# EAGLE design as_wounds_switches (EAGLE 9.6.2)
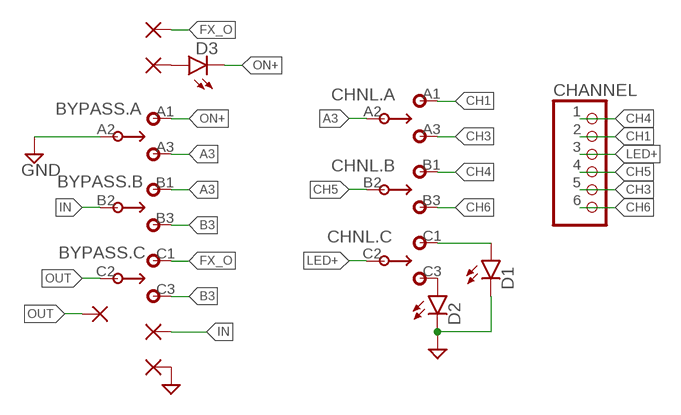
[diagram p0: schematic, sheet 1]

## Parts
BYPASS  3PDT.LUGS  [3PDT.LUGS]
CHANNEL  PINHD-1X6  [1X06]
CHNL  3PDT.LUGS  [3PDT.LUGS]
D1  LED.1  [3MM_IO]
D2  LED.1  [3MM_IO]
D3  LED.1  [3MM_IO]
PAD1  1,6/0,8  [1,6/0,8]
PAD2  1,6/0,8  [1,6/0,8]
PAD3  1,6/0,8  [1,6/0,8]
PAD4  1,6/0,8  [1,6/0,8]
PAD5  1,6/0,8  [1,6/0,8]

## Nets
A3: BYPASS.A3 BYPASS.B1 CHNL.A2
B3: BYPASS.B3 BYPASS.C3
CH1: CHANNEL.2 CHNL.A1
CH3: CHANNEL.5 CHNL.A3
CH4: CHANNEL.1 CHNL.B1
CH5: CHANNEL.4 CHNL.B2
CH6: CHANNEL.6 CHNL.B3
FX_O: BYPASS.C1 PAD1.1(P)
GND: BYPASS.A2 D1.K(C) D2.K(C) PAD4.1(P)
IN: BYPASS.B2 PAD3.1(P)
LED+: CHANNEL.3 CHNL.C2
N$1: CHNL.C3 D2.A
N$2: CHNL.C1 D1.A
N$4: D3.A PAD2.1(P)
ON+: BYPASS.A1 D3.K(C)
OUT: BYPASS.C2 PAD5.1(P)

## Library data of the parts
BYPASS CHNL = switches:3PDT: 3PDT Switches
CHANNEL = pinhead:PINHD-1X6: PIN HEADER
D1-D3 = diodes:LED: LEDs, all sizes 3mm: http://smallbear-electronics.mybigcommerce.com/led-t-1-3mm-diffused-colors/ 5mm: http://smallbear-electronics.mybigcommerce.com/led-t-1-3-4-5mm-diffused/
PAD1-PAD5 = wirepad:1,6/0,8: THROUGH-HOLE PAD

## Board
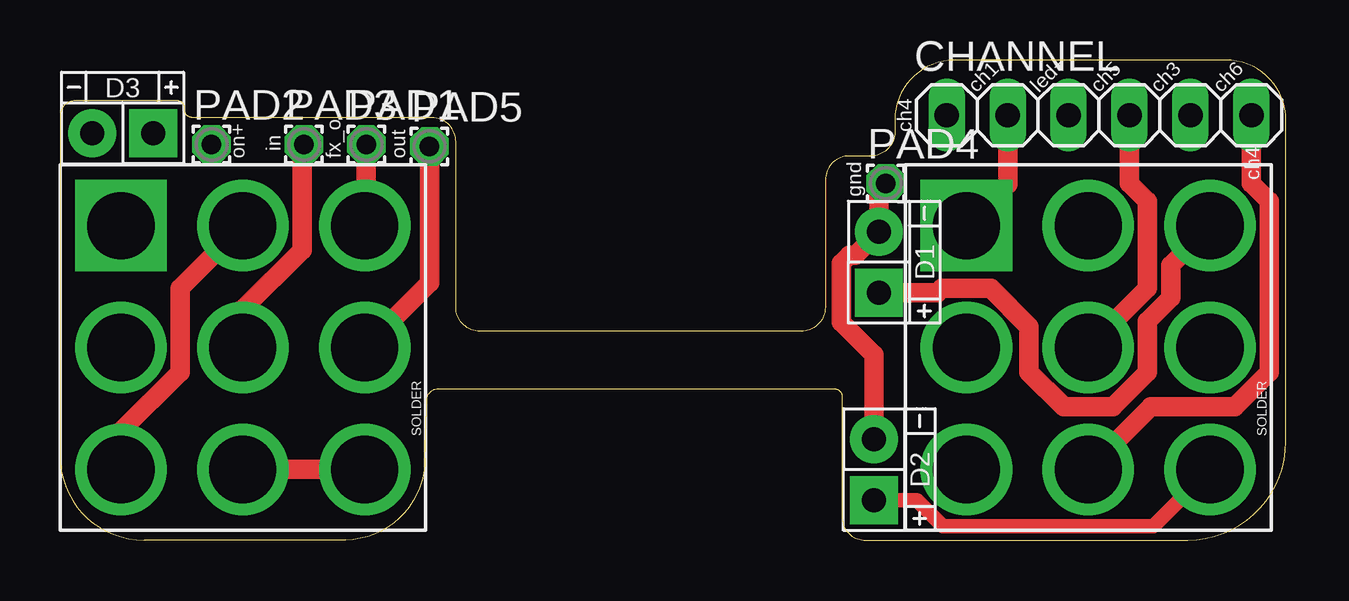
[diagram p1: board, top side]
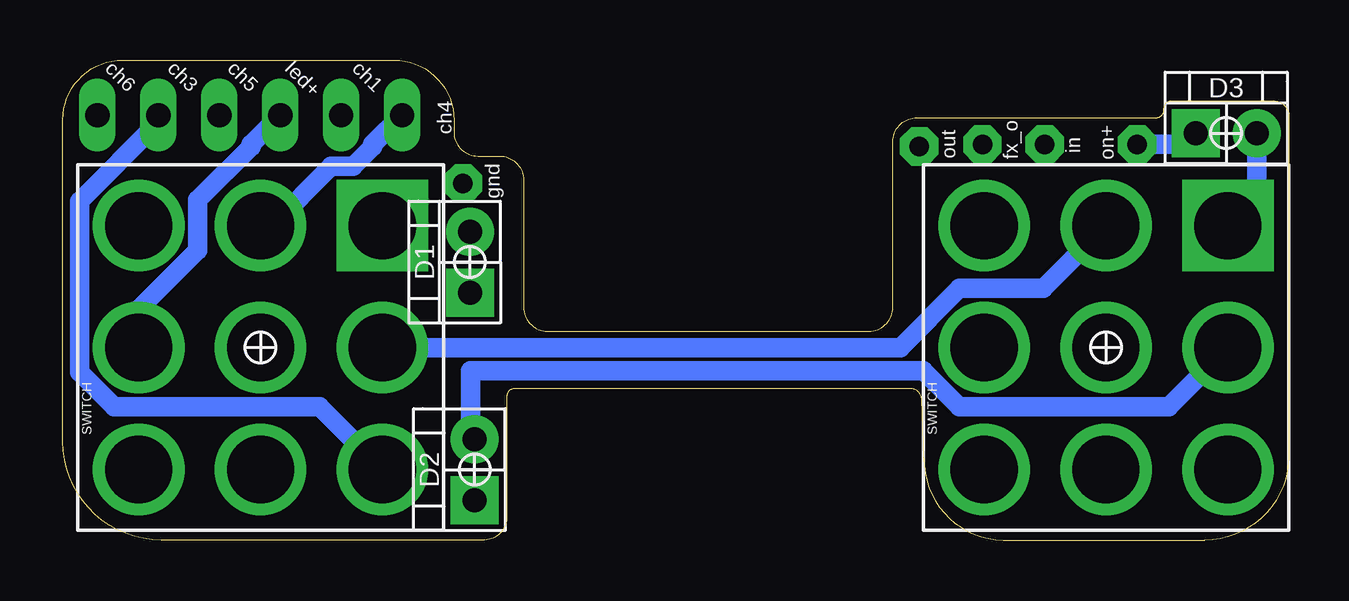
[diagram p2: board, bottom side, seen from below]

Size 51.1 x 20 mm. Coordinates in mm from the lower left corner, seen from the top.
Outline: 33.6,0 47,0 arc90 51.1,4.1 51.1,17.5 arc90 48.6,20 37.3,20 arc90 34.8,17.5 34.8,17 arc-90 33.8,16 32.9,16 arc90 31.9,15 31.9,9.7 arc-90 30.9,8.7 17.5,8.7 arc-90 16.5,9.7 16.5,16.6 arc90 15.5,17.6 5.52,17.6 arc-90 5.2,17.92 5.2,17.98 arc90 4.88,18.3 0.64,18.3 arc90 0,17.67 0,3.5 arc90 3.5,0 11.9,0 arc90 15.2,3.4 15.3,5.88 arc-90 15.82,6.3 32.28,6.3 arc-90 32.6,5.98 32.6,0.9 arc90 33.6,0
Copper layers (1*16): Top 0.035mm / dielectric 1.5mm / Bottom 0.035mm
Design rules "default *": minimum track width 6mil, minimum drill 0.35mm, track to track 6mil, track to pad 6mil, pad to pad 6mil, via to via 6mil, smd to smd 6mil, copper to edge 10mil, drill to drill 6mil, minimum pad ring 10mil, minimum via ring 8mil, stop-mask expansion 4mil, vias tented up to drill 0mil, thermal gap 10mil

### Footprints (pad centres in the part's own frame; a part is rotated, then mirrored left to right if it is on the bottom)
3PDT.LUGS = drill 2.8 square: A1 -5.08,5.08 | drill 2.8: A2 -5.08,0; A3 -5.08,-5.08; B1 0,5.08; B2 0,0; B3 0,-5.08; C1 5.08,5.08; C2 5.08,0; C3 5.08,-5.08
1X06 = drill 1.016 long: 1 -6.35,0; 2 -3.81,0; 3 -1.27,0; 4 1.27,0; 5 3.81,0; 6 6.35,0
3MM_IO = drill 1 pad 2 square: A -1.27,0 | drill 1 pad 2: K 1.27,0
1,6/0,8 = drill 0.813 pad 1.6 octagon: 1 0,0

### Placement (x,y rotation side)
BYPASS  7.62,8.02 0 top
CHANNEL  43.31,17.7 0 top
CHNL  42.86,8.02 0 top
D1  34.13,11.58 90 top
D2  33.93,2.93 90 top
D3  2.61,16.95 180 top
PAD1  12.77,16.48 0 top
PAD2  6.32,16.48 0 top
PAD3  10.17,16.48 0 top
PAD4  34.42,14.86 0 top
PAD5  15.4,16.4 0 top

### Tracks (layer width: path | path; a pad name or v marks a point on that pad's centre or on a via)
A3
  Top 0.813: BYPASS.A3 2.54,4.53 5.01,7 5.01,10.49 BYPASS.B1
  Bottom 0.813: BYPASS.B1 10.23,10.49 13.72,10.49 16.19,8.02 CHNL.A2
B3
  Top 0.813: BYPASS.B3 BYPASS.C3
CH1
  Top 0.813: CHANNEL.2 39.5,14.82 CHNL.A1
CH3
  Bottom 0.813: CHANNEL.5 47.12,17.41 50.41,14.12 50.41,7 48.96,5.55 40.39,5.55 CHNL.A3
CH4
  Bottom 0.813: CHANNEL.1 38.18,16.48 38.18,16.39 39,15.57 39.92,15.57 42.39,13.1 CHNL.B1
CH5
  Top 0.813: CHANNEL.4 44.58,14.87 45.33,14.12 45.33,10.49 CHNL.B2
CH6
  Top 0.813: CHANNEL.6 49.66,14.87 50.41,14.12 50.41,7 48.96,5.55 45.47,5.55 CHNL.B3
FX_O
  Top 0.813: PAD1.1 12.77,13.17 BYPASS.C1
GND
  Top 0.813: D2.K 33.93,7.72 32.57,9.08 32.57,11.54 32.9,11.87 33.15,11.87 D1.K 34.13,14.57 PAD4.1
  Bottom 0.813: BYPASS.A2 5.01,5.55 13.72,5.55 15.22,7.06 34.1,7.06 34.1,4.37 D2.K
IN
  Top 0.813: BYPASS.B2 7.62,9.61 10.09,12.08 10.09,16.4 PAD3.1
LED+
  Bottom 0.813: CHANNEL.3 43.26,16.48 43.26,16.39 45.47,14.18 45.47,12.08 47.94,9.61 CHNL.C2
N$1
  Top 0.61: D2.A 35.72,1.66 36.8,0.58 45.58,0.58 CHNL.C3
N$2
  Top 0.813: D1.A 36.58,10.31 36.76,10.49 38.8,10.49 40.39,8.9 40.39,7 41.84,5.55 43.88,5.55 45.33,7 45.33,9.12 46.29,10.09 46.29,11.45 CHNL.C1
N$4
  Bottom 0.813: D3.A 4.35,16.48 PAD2.1
ON+
  Bottom 0.813: D3.K 1.34,14.3 BYPASS.A1
OUT
  Top 0.813: BYPASS.C2 15.4,10.72 PAD5.1

### Text on the board
tPlace: ch1 | led+ | ch5 | ch3 | ch6 | ch4 | on+ | in | fx_o | out | ch4 | gnd
bPlace: ch1 | led+ | ch5 | ch3 | ch6 | fx_o | ch4 | on+ | in | out | gnd